# Altium schematic sheet imu.SchDoc
size A3
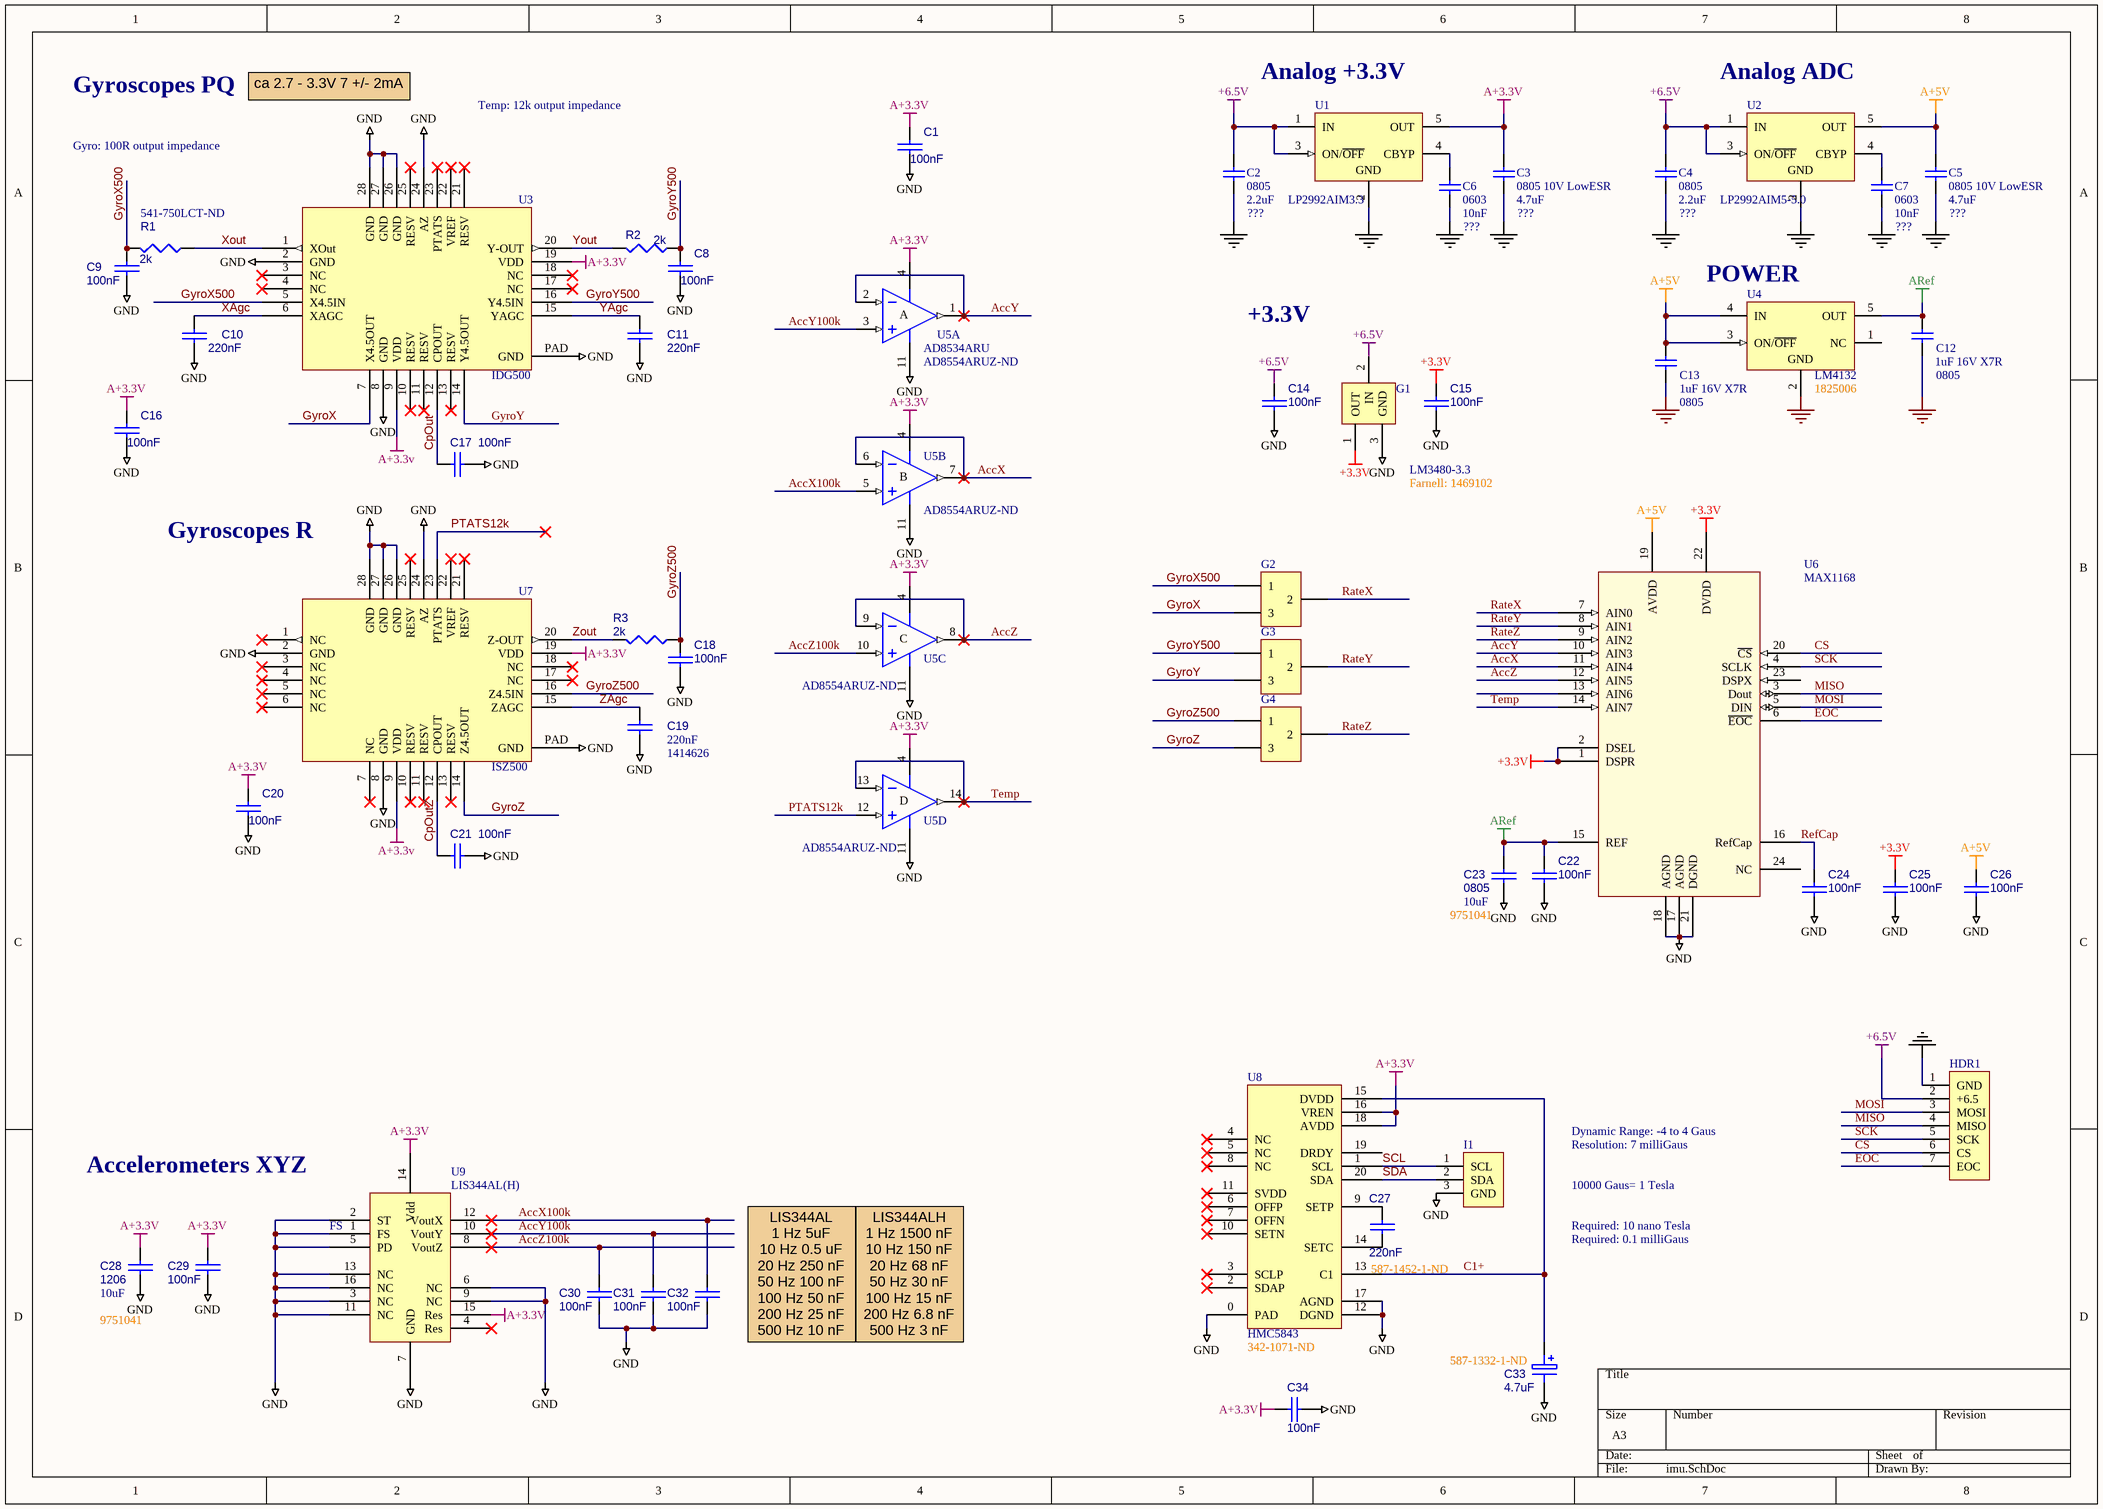
[diagram p0: imu.SchDoc]

## Parts
C1  100nF  [0603]
C2  0805  value 2.2uF  Farnell: ???  [0805]
C3  0805 10V LowESR  value 4.7uF  Farnell: ???  [0805]
C4  0805  value 2.2uF  Farnell: ???  [0805]
C5  0805 10V LowESR  value 4.7uF  Farnell: ???  [0805]
C6  0603  value 10nF  Farnell: ???  [0603]
C7  0603  value 10nF  Farnell: ???  [0603]
C8  100nF  [0603]
C9  100nF  [0603]
C10  220nF  [0603]
C11  220nF  [0603]
C12  0805  value 1uF 16V X7R  [0805]
C13  0805  value 1uF 16V X7R  [0805]
C14  100nF  [0603]
C15  100nF  [0603]
C16  100nF  [0603]
C17  100nF  [0603]
C18  100nF  [0603]
C19  farnell: 1414626  [0603]  (hidden comment: 220nF)
C20  100nF  [0603]
C21  100nF  [0603]
C22  100nF  [0603]
C23  0805  value 10uF  Farnell: 9751041  [0805]
C24  100nF  [0603]
C25  100nF  [0603]
C26  100nF  [0603]
C27  220nF  Supplier Part Number 1: 587-1452-1-ND  [0603]
C28  1206  value 10uF  Farnell: 9751041  [1206]
C29  100nF  [0603]
C30  100nF  [0603]
C31  100nF  [0603]
C32  100nF  [0603]
C33  4.7uF  Supplier Part Number 1: 587-1332-1-ND  [T491A]
C34  100nF  [0603]
G1  LM3480-3.3  Farnell: 1469102  [SOT23A_CDW]
G2  x1 x4.5  [3pin1mmpitch]  (value not drawn)  (no BOM)
G3  x1 x4.5  [3pin1mmpitch]  (value not drawn)  (no BOM)
G4  x1 x4.5  [3pin1mmpitch]  (value not drawn)  (no BOM)
HDR1  ADC_SPI  [PICOBLADE_53047-0710]  (value not drawn)
I1  I2C  [PICOBLADE_53047-0310]  (value not drawn)
R1  2k  Supplier Part Number 1: 541-750LCT-ND  [0603]
R2  2k  [0603]
R3  2k  [0603]
U1  LP2992AIM3.3  [MF05A_N]
U2  LP2992AIM5-5.0  [MF05A_N]
U3  IDG500  [QFN4x5]
U4  LM4132  Farnell: 1825006  [MF05A_N]
U5  AD8534ARU  Supplier Part Number 1: AD8554ARUZ-ND  [RU-14]  (parts A,B,C,D of 4)
U6  MAX1168  [SSOP24]
U7  ISZ500  [QFN4x5]
U8  HMC5843  Supplier Part Number 1: 342-1071-ND  [HMC5843]
U9  LIS344AL(H)  [ST_Lga16]

## Nets
+3.3V: C15.2 C25.2 G1.1(OUT) U6.1(DSPR) U6.2(DSEL) U6.22(DVDD)
+6.5V: C2.2 C4.2 C14.2 G1.2(IN) HDR1.2(+6.5) U1.1(IN) U1.3(ON/~{OFF}) U2.1(IN) U2.3(ON/~{OFF})
A+3.3v: C1.2 C3.2 C16.2 C20.2 C28.2 C29.2 C34.1 U1.5(OUT) U3.9(VDD) U3.19(VDD) U5.4(V+) U7.9(VDD) U7.19(VDD) U8.16(VREN) U8.18(AVDD) U9.14(Vdd) U9.15(Res)
A+5V: C5.2 C13.2 C26.2 U2.5(OUT) U4.3(ON/~{OFF}) U4.4(IN) U6.19(AVDD)
ARef: C12.2 C22.2 C23.2 U4.5(OUT) U6.15(REF)
GND: C1.1 C2.1 C3.1 C4.1 C5.1 C6.1 C7.1 C8.1 C9.1 C10.1 C11.1 C12.1 C13.1 C14.1 C15.1 C16.1 C17.1 C18.1 C19.1 C20.1 C21.1 C22.1 C23.1 C24.1 C25.1 C26.1 C28.1 C29.1 C30.1 C31.1 C32.1 C33.2 C34.2 G1.3(GND) HDR1.1(GND) I1.3(GND) U1.2(GND) U2.2(GND) U3.2(GND) U3.8(GND) U3.24(AZ) U3.26(GND) U3.27(GND) U3.28(GND) U3.PAD(GND) U4.2(GND) U5.11(V-) U6.17(AGND) U6.18(AGND) U6.21(DGND) U7.2(GND) U7.8(GND) U7.24(AZ) U7.26(GND) U7.27(GND) U7.28(GND) U7.PAD(GND) U8.0(PAD) U8.12(DGND) U8.17(AGND) U9.1(FS) U9.2(ST) U9.3(NC) U9.5(PD) U9.6(NC) U9.7(GND) U9.9(NC) U9.11(NC) U9.13(NC) U9.16(NC)
AccX: U5.6(IN-) U5.7(OUT) U6.11(AIN4)
AccX100k: C32.2 U5.5(IN+) U9.12(VoutX)
AccY: U5.1(OUT) U5.2(IN-) U6.10(AIN3)
AccY100k: C31.2 U5.3(IN+) U9.10(VoutY)
AccZ: U5.8(OUT) U5.9(IN-) U6.12(AIN5)
AccZ100k: C30.2 U5.10(IN+) U9.8(VoutZ)
C1+: C33.1 U8.13(C1) U8.15(DVDD)
CpOut: C17.2 U3.12(CPOUT)
CpOutZ: C21.2 U7.12(CPOUT)
CS: HDR1.6(CS) U6.20(~{CS})
EOC: HDR1.7(EOC) U6.6(~{EOC})
GyroX: G2.3 U3.7(X4.5OUT)
GyroX500: C9.2 G2.1 R1.2 U3.5(X4.5IN)
GyroY: G3.3 U3.14(Y4.5OUT)
GyroY500: C8.2 G3.1 R2.1 U3.16(Y4.5IN)
GyroZ: G4.3 U7.14(Z4.5OUT)
GyroZ500: C18.2 G4.1 R3.1 U7.16(Z4.5IN)
MISO: HDR1.4(MISO) U6.3(Dout)
MOSI: HDR1.3(MOSI) U6.5(DIN)
PTATS12k: U5.12(IN+) U7.23(PTATS)
RateX: G2.2 U6.7(AIN0)
RateY: G3.2 U6.8(AIN1)
RateZ: G4.2 U6.9(AIN2)
RefCap: C24.2 U6.16(RefCap)
SCK: HDR1.5(SCK) U6.4(SCLK)
SCL: I1.1(SCL) U8.1(SCL)
SDA: I1.2(SDA) U8.20(SDA)
Temp: U5.13(IN-) U5.14(OUT) U6.14(AIN7)
XAgc: C10.2 U3.6(XAGC)
Xout: R1.1 U3.1(XOut)
YAgc: C11.2 U3.15(YAGC)
Yout: R2.2 U3.20(Y-OUT)
ZAgc: C19.2 U7.15(ZAGC)
Zout: R3.2 U7.20(Z-OUT)
NetC6_2: C6.2 U1.4(CBYP)
NetC7_2: C7.2 U2.4(CBYP)
NetC27_1: C27.1 U8.14(SETC)
NetC27_2: C27.2 U8.9(SETP)

Not connected (* = marked no-connect by the designer): U3 3(NC)* 4(NC)* 10(RESV)* 11(RESV)* 13(RESV)* 17(NC)* 18(NC)* 21(RESV)* 22(VREF)* 23(PTATS)* 25(RESV)*; U4 1(NC); U6 13(AIN6) 23(DSPX) 24(NC); U7 1(NC)* 3(NC)* 4(NC)* 5(NC)* 6(NC)* 7(NC)* 10(RESV)* 11(RESV)* 13(RESV)* 17(NC)* 18(NC)* 21(RESV)* 22(VREF)* 25(RESV)*; U8 2(SDAP)* 3(SCLP)* 4(NC)* 5(NC)* 6(OFFP)* 7(OFFN)* 8(NC)* 10(SETN)* 11(SVDD)* 19(DRDY); U9 4(Res)*

## Notes on the sheet
- Gyroscopes PQ
- ca 2.7 - 3.3V 7 +/- 2mA
- Temp: 12k output impedance
- (near U1) Analog +3.3V
- (near U2) Analog ADC
- Gyro: 100R output impedance
- (near U4) POWER
- +3.3V
- Gyroscopes R
- Accelerometers XYZ
- Dynamic Range: -4 to 4 Gaus
- Resolution: 7 milliGaus
- 10000 Gaus= 1 Tesla
- (near U9) FS
- Required: 10 nano Tesla
- Required: 0.1 milliGaus
- (near C32) LIS344AL
  1 Hz 5uF
  10 Hz 0.5 uF
  20 Hz 250 nF
  50 Hz 100 nF
  100 Hz 50 nF
  200 Hz 25 nF
  500 Hz 10 nF
- LIS344ALH
  1 Hz 1500 nF
  10 Hz 150 nF
  20 Hz 68 nF
  50 Hz 30 nF
  100 Hz 15 nF
  200 Hz 6.8 nF
  500 Hz 3 nF
- (in symbol AD8534ARU, part A) A
- (in symbol AD8534ARU, part B) B
- (in symbol AD8534ARU, part C) C
- (in symbol AD8534ARU, part D) D

## Library data of the parts
C1 C8-C11 C14-C32 C34 = CAP
  C1 C8 C9 C14-C18 C20-C22 C24-C26 C29-C32: value: 100nF
  C10 C11 C19: value: 220nF
  C27: Supplier 1: Digi-Key
C2-C7 C12 C13 = Cap: Capacitor
  C2-C7: Published: 8-Jun-2000; Revision: July-2002: Re-released for DXP Platform.; Publisher: Altium Limited
  C12 C13: Revision: Jan-2010; Farnell: 9527710
C33 = ELECTRO1: Supplier 1: Digi-Key
G1-G4 I1 = Header 3: Header, 3-Pin; Publisher: Altium Limited; LatestRevisionDate: 17-Jul-2002; LatestRevisionNote: Re-released for DXP Platform.
HDR1 = Header 7: Header, 7-Pin; Publisher: Altium Limited; LatestRevisionDate: 17-Jul-2002; LatestRevisionNote: Re-released for DXP Platform.
R1-R3 = RES1: value: 750R
  R1: Supplier 1: Digi-Key
U1 U2 = LP2992AIM5-5.0: Micropower 250 mA Low-Noise Ultra Low-Dropout Regulator in SOT-23 and LLP Packages; Manufacturer: National Semiconductor; CompType: LDO IC; PackageTopMarking: LFFA*XTT; Published: 4-Dec-2008; DatasheetVersion: May-2005; PackageVersion: revD, Aug-2008; PackageReference: MF05A; Publisher: Altium Limited; PackageDescription: Molded SOT-23, .115 x .063 x .040 in Body, 5 Lead, .0375 in Pitch; PartNumber: LP2992AIM5-5.0; RoHS: O; PinCount: 5; DigiKeyPartNumber: LP2992AIM5-5.0CT-ND; Code_IPC: SOT23-5; ComponentLink1Description: LP2992 Datasheet; ComponentLink1URL: http://www.national.com/ds/LP/LP2992.pdf; ComponentLink2Description: LP2992 Web Page; ComponentLink2URL: http://www.national.com/pf/LP/LP2992.html; ComponentLink3Description: MF05A Package Page; ComponentLink3URL: http://www.national.com/packaging/folders/mf05a.html
U3 = IDG500: INVENSENSE Integrated Dual Axis Gyroscope
U4 = LP2981AIM5-2.5: Micropower 100 mA Ultra Low-Dropout Regulator in SOT-23 and micro SMD Packages; Revision: Jan-2010; Value: LP2981AIM5-2.5
U5 = AD8534ARU: Low Cost, 250 mA Output Single-Supply Amplifier; Published: 8-Jun-2000; LatestRevisionDate: 04-Mar-2005; LatestRevisionNote: Stylized 3D Model Added.; DatasheetVersion: REV. A 1997; PackageVersion: 2005; PackageReference: RU-14; Publisher: Altium Limited; PackageDescription: Shrink Small Outline, TSSOP; 14 Leads; Body Width 4.4 mm; Pitch 0.65 mm; Code_JEDEC: MO-153-AB-1; ComponentLink1Description: Manufacturer Link; ComponentLink1URL: http://www.analog.com/en/prod/0,,759_786_AD8531%2C00.html; ComponentLink2Description: Datasheet; ComponentLink2URL: http://www.analog.com/UploadedFiles/Data_Sheets/93565307AD8531_2_4_E.pdf; Supplier 1: Digi-Key
U6 = MAX1168: ADC
U7 = ISZ500: INVENSENSE SingleZ Gyroscope
U8 = HMC5843: Honeywell 3 Axis Compass I2C; Supplier 1: Digi-Key
U9 = LIS344AL